# Altium schematic sheet Main.SchDoc
size A4; SheetNumber: 1; SheetTotal: 1
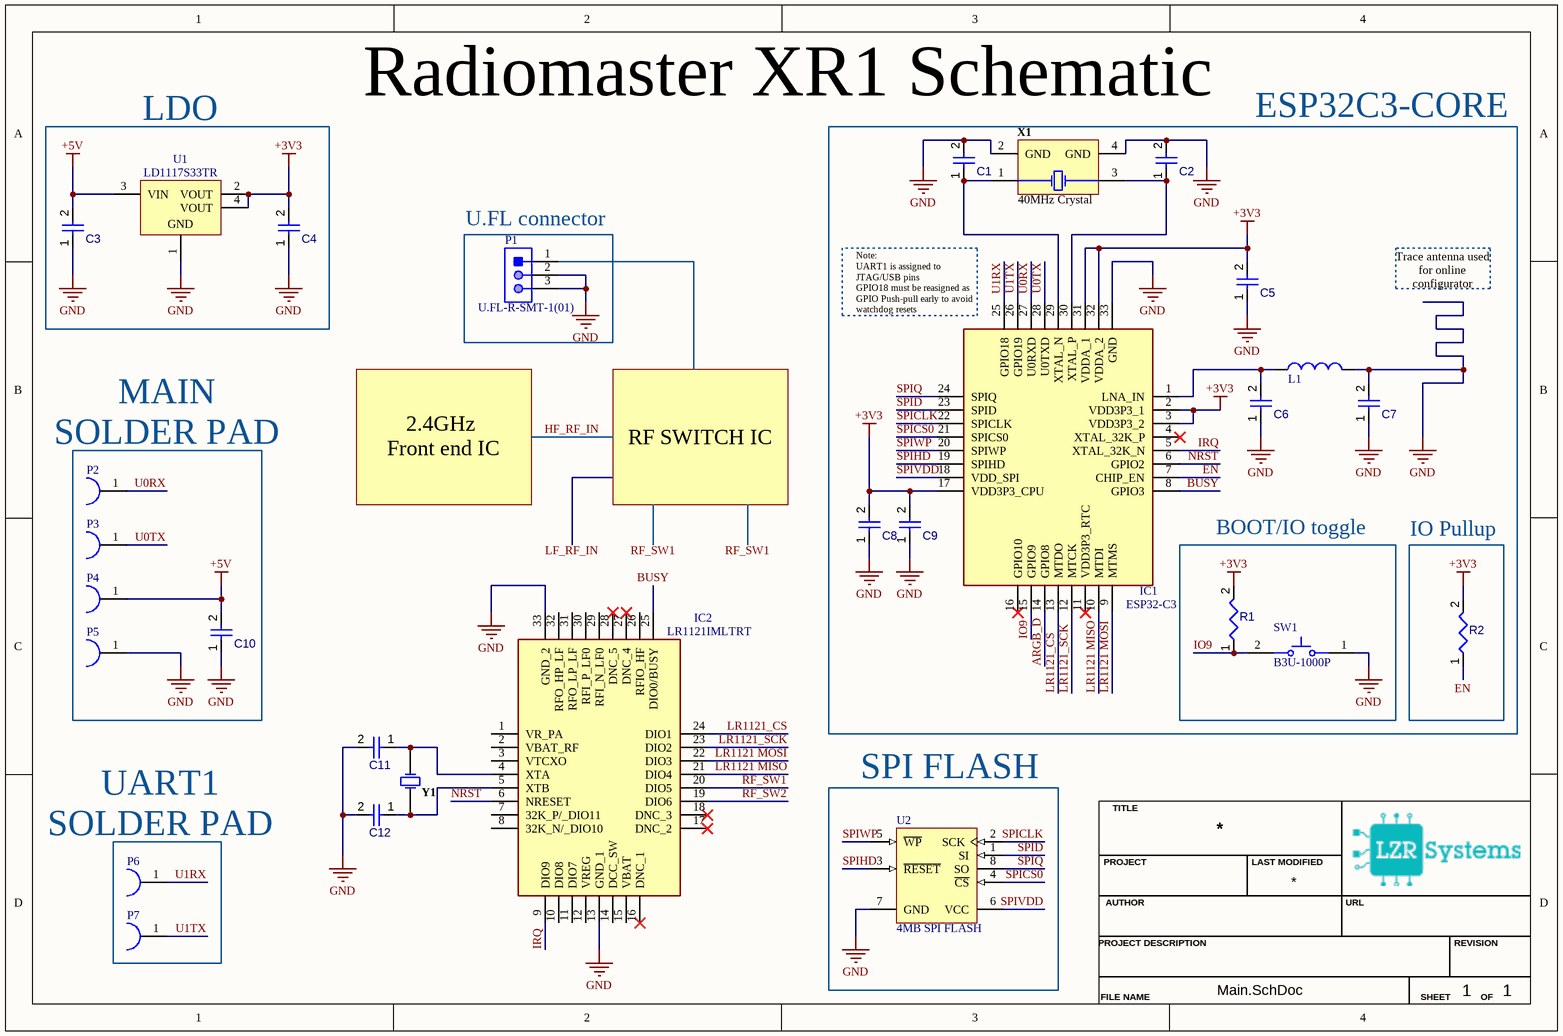
[diagram p0: Main.SchDoc]

## Parts
C1  Capacitors  (value not drawn)
C2  Capacitors  (value not drawn)
C3  Capacitors  (value not drawn)
C4  Capacitors  (value not drawn)
C5  Capacitors  (value not drawn)
C6  Capacitors  (value not drawn)
C7  Capacitors  (value not drawn)
C8  Capacitors  (value not drawn)
C9  Capacitors  (value not drawn)
C10  Capacitors  (value not drawn)
C11  Capacitors  (value not drawn)
C12  Capacitors  (value not drawn)
IC1  ESP32-C3  [QFN50P500X500X90-33N-D]
IC2  LR1121IMLTRT  [QFN50P500X500X100-33N-D]
L1  Inductors  (value not drawn)
P1  U.FL-R-SMT-1(01)  [HRS-U.FL-R-SMT-3_V]
P2  Solder Pad 2x1.5mm  [Solder Pad 2x1.5mm-Footprint-1]  (value not drawn)
P3  Solder Pad 2x1.5mm  [Solder Pad 2x1.5mm-Footprint-1]  (value not drawn)
P4  Solder Pad 2x1.5mm  [Solder Pad 2x1.5mm-Footprint-1]  (value not drawn)
P5  Solder Pad 2x1.5mm  [Solder Pad 2x1.5mm-Footprint-1]  (value not drawn)
P6  Solder Pad 2x1.5mm  [Solder Pad 2x1.5mm-Footprint-1]  (value not drawn)
P7  Solder Pad 2x1.5mm  [Solder Pad 2x1.5mm-Footprint-1]  (value not drawn)
R1  Resistors  (value not drawn)
R2  Resistors  (value not drawn)
SW1  B3U-1000P  [OMRON-B3U-1000_V]
U1  LD1117S33TR  [STM-SOT-223_M]
U2  4MB SPI FLASH  [ADST-8S1_M]
X1  40MHz Crystal  [ABRA-ABM3B-4_V]
Y1  Crystals & Oscillators  (value not drawn)

## Blocks framed on the sheet
ESP32C3-CORE: C1 C2 C5-C9 IC1 L1 X1
U.FL connector: P1
BOOT/IO toggle: R1 SW1
IO Pullup: R2
SPI FLASH: U2

## Nets
+3V3: C4.2 C5.2 C8.2 C9.2 IC1.2(VDD3P3_1) IC1.3(VDD3P3_2) IC1.17(VDD3P3_CPU) IC1.31(VDDA_1) IC1.32(VDDA_2) R1.2 R2.2 U1.2(VOUT) U1.4(VOUT)
+5V: C3.2 C10.2 P4.1 U1.3(VIN)
GND: C1.2 C2.2 C3.1 C4.1 C5.1 C6.1 C7.1 C7.2 C8.1 C9.1 C10.1 C11.2 C12.2 IC1.33(GND) IC2.13(GND_1) IC2.33(GND_2) L1.1 P1.2 P1.3 P5.1 SW1.1 U1.1(GND) U2.7(GND) X1.2(GND) X1.4(GND)
ARGB_D: IC1.14(GPIO8)
BUSY: IC1.8(GPIO3) IC2.25(DIO0/BUSY)
EN: IC1.7(CHIP_EN) R2.1
IO9: IC1.15(GPIO9) R1.1 SW1.2
IRQ: IC1.5(XTAL_32K_N) IC2.9(DIO9)
LR1121 MISO: IC1.10(MTDI) IC2.21(DIO4)
LR1121 MOSI: IC1.9(MTMS) IC2.22(DIO3)
LR1121_CS: IC1.13(MTDO) IC2.24(DIO1)
LR1121_SCK: IC1.12(MTCK) IC2.23(DIO2)
NRST: IC1.6(GPIO2) IC2.6(NRESET)
RF_SW1: IC2.20(DIO5)
RF_SW2: IC2.19(DIO6)
SPICLK: IC1.22(SPICLK) U2.2(SCK)
SPICS0: IC1.21(SPICS0) U2.4(~{CS})
SPID: IC1.23(SPID) U2.1(SI)
SPIHD: IC1.19(SPIHD) U2.3(~{RESET})
SPIQ: IC1.24(SPIQ) U2.8(SO)
SPIVDD: IC1.18(VDD_SPI) U2.6(VCC)
SPIWP: IC1.20(SPIWP) U2.5(~{WP})
U0RX: IC1.27(U0RXD) P2.1
U0TX: IC1.28(U0TXD) P3.1
U1RX: IC1.25(GPIO18) P6.1
U1TX: IC1.26(GPIO19) P7.1
NetC1_1: C1.1 IC1.29(XTAL_N) X1.1(X1)
NetC2_1: C2.1 IC1.30(XTAL_P) X1.3(X2)
NetC6_2: C6.2 IC1.1(LNA_IN) L1.2
NetC11_1: C11.1 IC2.4(XTA) Y1.2
NetC12_1: C12.1 IC2.5(XTB) Y1.1

Not connected (* = marked no-connect by the designer): IC1 4(XTAL_32K_P)* 11(VDD3P3_RTC)* 16(GPIO10)*; IC2 1(VR_PA) 2(VBAT_RF) 3(VTCXO) 7(32K_P/_DIO11) 8(32K_N/_DIO10) 10(DIO8) 11(DIO7) 12(VREG) 14(DCC_SW) 15(VBAT) 16(DNC_1)* 17(DNC_2)* 18(DNC_3)* 26(RFIO_HF) 27(DNC_4)* 28(DNC_5)* 29(RFI_N_LF0) 30(RFI_P_LF0) 31(RFO_LP_LF) 32(RFO_HP_LF); P1 1

## Notes on the sheet
- Radiomaster XR1 Schematic
- LDO
- (near IC1) Note:
  UART1 is assigned to JTAG/USB pins
  GPIO18 must be reasigned as GPIO Push-pull early to avoid watchdog resets
- Trace antenna used for online configurator
- (near P2) MAIN
  SOLDER PAD
- RF SWITCH IC
- 2.4GHz
  Front end IC
- (near P6) UART1
  SOLDER PAD
- Labels drawn without touching a wire or pin: HF_RF_IN, LF_RF_IN, RF_SW1
- TITLE
- AUTHOR
- PROJECT
- LAST MODIFIED
- URL
- PROJECT DESCRIPTION
- REVISION
- FILE NAME
- SHEET
- OF

## Library data of the parts
C1-C12 = Capacitors: Capacitor; Component Type: Capacitors
IC1 = ESP32-C3: Integrated Circuit; Manufacturer_Name: Espressif Systems; Datasheet Link: https://www.espressif.com/sites/default/files/documentation/esp32-c3_datasheet_en.pdf; Height: 0.9mm; Manufacturer_Part_Number: ESP32-C3; Mouser Part Number: 356-ESP32-C3; Mouser Price/Stock: https://www.mouser.co.uk/ProductDetail/Espressif-Systems/ESP32-C3?qs=iLbezkQI%252BsiMXe7tMG%252Bo%2FA%3D%3D
IC2 = LR1121IMLTRT: Integrated Circuit; Manufacturer_Name: SEMTECH; Datasheet Link: https://semtech.my.salesforce.com/sfc/p/#E0000000JelG/a/3n000000v5Si/w76yOLVE0v.G27kJ8qsY4sb86oymvTIhxqK.Euzn2z0; Height: 1mm; Manufacturer_Part_Number: LR1121IMLTRT; Mouser Part Number: 947-LR1121IMLTRT; Mouser Price/Stock: https://www.mouser.co.uk/ProductDetail/Semtech/LR1121IMLTRT?qs=amGC7iS6iy%252B8g9GIMO%2FdBw%3D%3D; Arrow Part Number: LR1121IMLTRT; Arrow Price/Stock: https://www.arrow.com/en/products/lr1121imltrt/semtech?utm_currency=USD&region=nac
P1 = CMP-002-00083-1: Rf Connectors / Coaxial Connectors SMT Ml Rec Au 50 Ohm W/anti Sldr Wicking; Connector Type: Receptacle; Max Operating Temperature: 90°C; Pins: 1; Mounting Technology: Surface Mount; Min Operating Temperature: -40°C
P2-P7 = CMP-00001-1: Solder Pad 2x1.5mm, 0.5mm hole
R1 R2 = Resistors: Resistor; Component Type: Resistors
SW1 = CMP-011-00000-2: Tactile Switch, SPST-NO, 0.05 A, 12 V, -25 to 70 degC, 2-Pin SMD, RoHS, Tape and Reel; Manufacturer: Omron Electronic Components; IP Rating: IP40; Current Rating: 50mA; Max Contact Resistance: 100mohm; Operating Force: 153gf; Throw Configuration: SPST; Resistance: 0.1Ohm; Max Voltage Rating (DC): 12V; Contact Material: Silver; Max Current Rating: 50mA; Datasheet URL: http://www.omron.com/ecb/products/pdf/en-b3u.pdf; Mounting Technology: SM; Case/Package: B3U-1000; Packaging: TapeandReel; Package Reference: B3U-1000; Manufacturer URL: http://www.omron.com/; Datasheet Version: Jan-15; RoHS Compliant: True; Max Operating Temperature: 70°C; Contact Current Rating: 50mA; Package Quantity: 3500; Package Description: 2-Pin Surface Mount Device, Body 3 x 2.5 mm; Voltage Rating (DC): 12V; Min Operating Temperature: -25°C; Voltage Rating: 12V
U1 = CMP-019-00019-3: Low Drop Positive Voltage Regulator, 800 mA, Fixed 3.3 V Output, 0 to 125 degC, 3-Pin TO-220, RoHS, Tape and Reel; Manufacturer: STMicroelectronics; Max Supply Voltage: 15V; Dropout Voltage: 1.1V; Power: 12W; Output Current: 950mA; Min Input Voltage: 4.75V; Nominal Output Voltage: 3.3V; Max Ouput Current: 1.3A; Outputs: 1; Packaging: TapeandReel; Datasheet Version: Rev. 33, 11/2013; RoHS Compliant: True; Mounting Technology: SM; Max Input Voltage: 15V; Max Operating Temperature: 125°C; Package Reference: SOT-223; Package Quantity: 2500; Package Description: 4-Pin Small Outline Transistor, Body 6.5 x 3.5 mm, Pitch 2.3 mm; Case/Package: TO-261-4; Min Operating Temperature: 0°C; Datasheet URL: http://www.farnell.com/datasheets/1776449.pdf; Min Supply Voltage: 4.75V; Pins: 3; Output Voltage: 3.3V; Manufacturer URL: http://www.st.com/
U2 = CMP-019-00002-3: SPI Serial Flash Memory, 4-Mbit, 1.65 to 3.6 V, -40 to 85 degC, 8-Pin SOIC (8S1), RoHS, Tube; Manufacturer: Adesto; Max Clock Frequency: 70MHz; Access Time: 7ns; Nominal Supply Current: 15mA; Page Size: 264B; Nominal Supply Voltage: 1.8V; Word Size: 8b; Max Supply Voltage: 3.6V; Clock Frequency: 85MHz; Min Supply Voltage: 1.65V; Pins: 8; RoHS Compliant: True; Package Description: 8-Pin Small Outline Integrated Circuit, Body 4.925 x 3.9 mm, Pitch 1.27 mm; Mounting Technology: SM; Manufacturer URL: http://www.adestotech.com/; Packaging: Rail/Tube; Package Reference: 8S1; Min Operating Temperature: -40°C; Max Operating Temperature: 85°C; Density: 4Mb; Case/Package: SOIC; Package Quantity: 98; Datasheet URL: http://www.adestotech.com/wp-content/uploads/doc8783.pdf; Datasheet Version: Rev. 8783I, 03/2016; Interface: SPI
X1 = CMP-003-00020-2: Ceramic SMD Crystal, 40 MHz, +/- 20 ppm, 18 pF, -20 to 70 degC, 4-Pin SMD, RoHS, Tape and Reel; Manufacturer: Abracon; Tolerance: 20ppm; Load Capacitance: 18pF; ESR: 50; Frequency: 40MHz; Case/Package: CSMD; RoHS Compliant: True; Package Quantity: 1000; Manufacturer URL: http://www.abracon.com/; Mounting Technology: SM; Min Operating Temperature: -20°C; Datasheet Version: Aug-15; Package Reference: ABM3B; Package Description: 4-Pin Surface Mount Device, Body 5 x 3.2 mm; Max Operating Temperature: 70°C; Packaging: TapeandReel; Frequency Tolerance: 20ppm; Datasheet URL: http://www.abracon.com/Resonators/abm3b.pdf
Y1 = Crystals & Oscillators: Crystal; Component Type: Crystals & Oscillators
L1 = Inductors: Component Type: Inductors